# Altium schematic sheet CAN_Transceiver.SchDoc
size A4; SheetNumber: 6; SheetTotal: 6
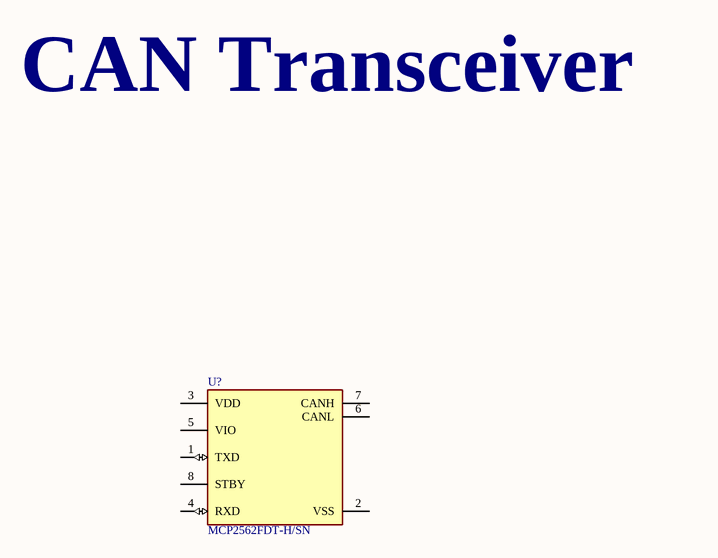
[diagram p0: CAN_Transceiver.SchDoc]

## Parts
U?  MCP2562FDT-H/SN  [FP-C04-057-SN-IPC_A]

## Nets

Not connected (* = marked no-connect by the designer): U? 1(TXD) 2(VSS) 3(VDD) 4(RXD) 5(VIO) 6(CANL) 7(CANH) 8(STBY)

## Notes on the sheet
- CAN Transceiver

## Library data of the parts
U? = CMP-06279-000047-1: IC TRANSCEIVER 1/1 8SOIC; Operating Supply Current: 70mA; Receiver Hysteresis: 200mV; Max Supply Voltage: 5.5V; Number of Transceivers: 1; Min Supply Voltage: 4.5V; Data Rate: 8Mbps; Case/Package: SOIC; Weight: 0.019048oz; Package Quantity: 3300; Max Operating Temperature: 150°C; Packaging: Tape and Reel; RoHS Compliant: Yes; Series: -; Number of Pins: 8; Min Operating Temperature: -40°C; Mount: Surface Mount